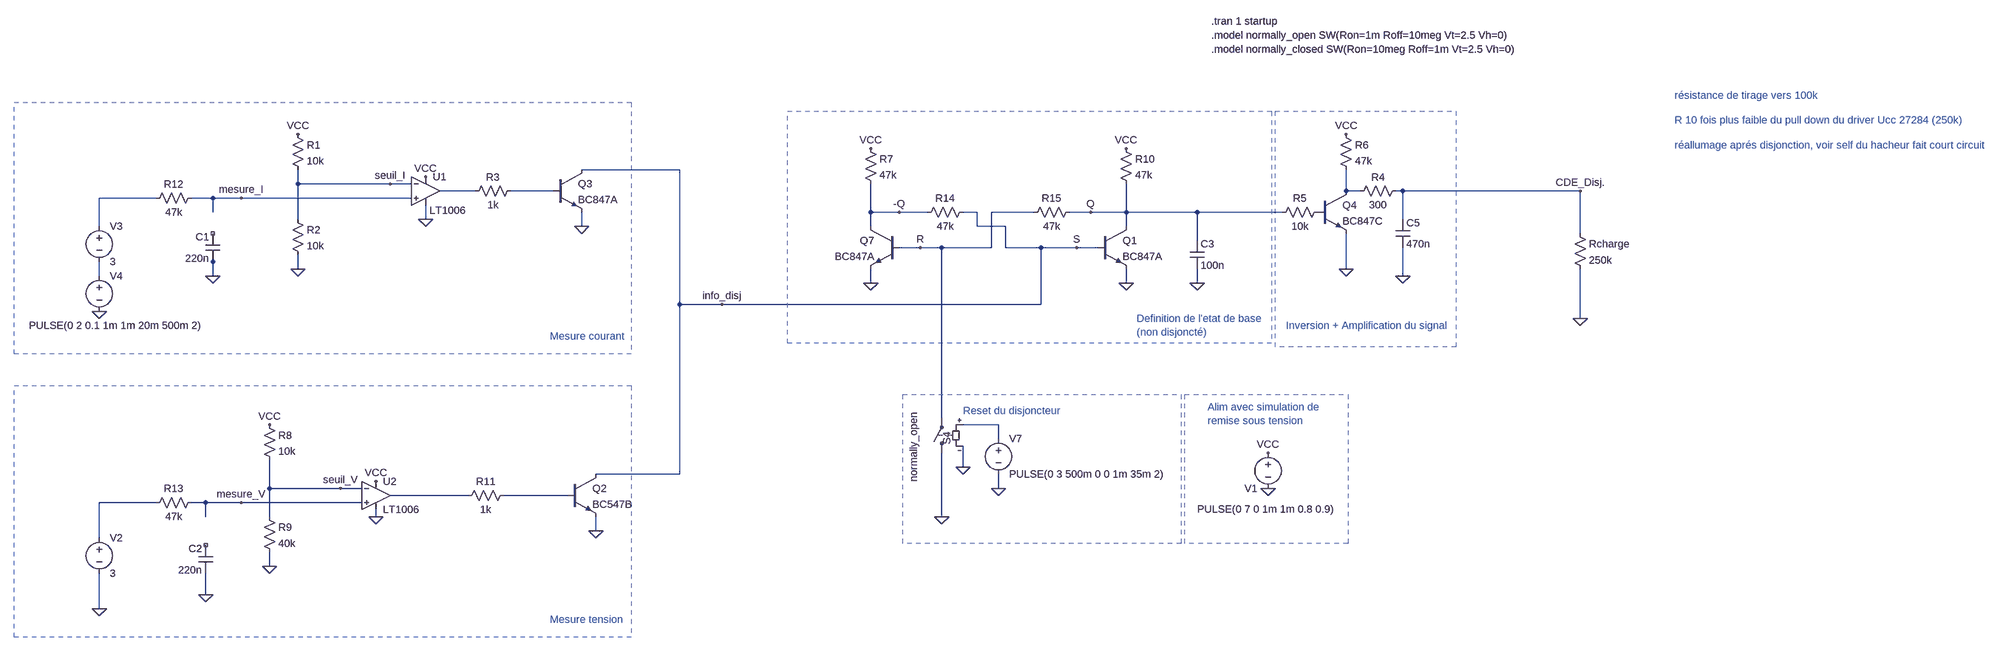
[diagram p0: schematic Sesame_disjoncteur_basculeRS_3t.asc]
Sesame_disjoncteur_basculeRS_3t.asc, the LTspice schematic file:
Version 4
SHEET 1 4456 1012
WIRE 816 -48 592 -48
WIRE -48 -16 -48 -48
WIRE 160 -16 -48 -16
WIRE 208 -16 160 -16
WIRE 352 0 272 0
WIRE 528 0 432 0
WIRE 2336 0 2336 -48
WIRE 2368 0 2336 0
WIRE 2464 0 2448 0
WIRE 2864 0 2464 0
WIRE -368 16 -496 16
WIRE -240 16 -288 16
WIRE -176 16 -240 16
WIRE 208 16 -176 16
WIRE -240 48 -240 16
WIRE 1264 48 1264 -16
WIRE 1328 48 1264 48
WIRE 1392 48 1328 48
WIRE 1504 48 1472 48
WIRE 1632 48 1536 48
WIRE 1760 48 1712 48
WIRE 1840 48 1840 -16
WIRE 1840 48 1760 48
WIRE 2000 48 1840 48
WIRE 2192 48 2000 48
WIRE -48 64 -48 -16
WIRE 240 64 240 32
WIRE 2464 64 2464 0
WIRE -496 80 -496 16
WIRE 592 80 592 48
WIRE 1264 80 1264 48
WIRE 1504 80 1504 48
WIRE 1568 80 1504 80
WIRE 1840 80 1840 48
WIRE 2864 96 2864 0
WIRE 2000 112 2000 48
WIRE 1376 128 1328 128
WIRE 1424 128 1376 128
WIRE 1536 128 1536 48
WIRE 1536 128 1424 128
WIRE 1568 128 1568 80
WIRE 1648 128 1568 128
WIRE 1728 128 1648 128
WIRE 1776 128 1728 128
WIRE -240 160 -240 144
WIRE -48 176 -48 144
WIRE 2336 176 2336 96
WIRE -496 192 -496 160
WIRE -240 192 -240 160
WIRE 2464 192 2464 128
WIRE 1264 208 1264 176
WIRE 1840 208 1840 176
WIRE 2000 208 2000 176
WIRE 816 256 816 -48
WIRE 912 256 816 256
WIRE 1648 256 1648 128
WIRE 1648 256 912 256
WIRE 2864 288 2864 176
WIRE 1424 512 1424 128
WIRE 1552 528 1472 528
WIRE 1552 560 1552 528
WIRE 1472 624 1472 576
WIRE 816 640 816 256
WIRE 816 640 624 640
WIRE -112 672 -112 608
WIRE 48 672 -112 672
WIRE 96 672 48 672
WIRE 1552 672 1552 640
WIRE 336 688 160 688
WIRE 560 688 416 688
WIRE -368 704 -496 704
WIRE -256 704 -288 704
WIRE -176 704 -256 704
WIRE 96 704 -176 704
WIRE -256 736 -256 704
WIRE -112 736 -112 672
WIRE 128 736 128 720
WIRE 1424 736 1424 592
WIRE 624 768 624 736
WIRE -496 784 -496 704
WIRE -112 848 -112 816
WIRE -256 912 -256 864
WIRE -496 944 -496 864
FLAG 240 64 0
FLAG 592 80 0
FLAG 128 736 0
FLAG -48 176 0
FLAG -112 848 0
FLAG 1264 208 0
FLAG 1840 208 0
FLAG 624 768 0
FLAG 2864 288 0
FLAG -176 16 mesure_I
FLAG -176 704 mesure_V
FLAG 48 672 seuil_V
FLAG 160 -16 seuil_I
FLAG 2864 0 CDE_Disj.
FLAG 912 256 info_disj
FLAG -240 192 0
FLAG -256 912 0
FLAG 1472 624 0
FLAG 1552 672 0
FLAG 2336 176 0
FLAG 1424 736 0
FLAG 2000 208 0
FLAG 2464 192 0
FLAG -496 272 0
FLAG -496 944 0
FLAG 1264 -96 VCC
FLAG 1840 -96 VCC
FLAG 240 -32 VCC
FLAG 128 656 VCC
FLAG -112 528 VCC
FLAG -48 -128 VCC
FLAG 2160 592 VCC
FLAG 2160 672 0
FLAG 1376 128 R
FLAG 1728 128 S
FLAG 1760 48 Q
FLAG 1328 48 -Q
FLAG 2336 -128 VCC
SYMBOL res -64 -144 R0
SYMATTR InstName R1
SYMATTR Value 10k
SYMBOL res -64 48 R0
SYMATTR InstName R2
SYMATTR Value 10k
SYMBOL res -128 512 R0
SYMATTR InstName R8
SYMATTR Value 10k
SYMBOL res -128 720 R0
SYMATTR InstName R9
SYMATTR Value 40k
SYMBOL LT1006 240 -64 R0
WINDOW 3 9 108 Left 2
SYMATTR InstName U1
SYMBOL LT1006 128 624 R0
SYMATTR InstName U2
SYMBOL voltage 2160 576 M0
WINDOW 0 24 96 Left 2
WINDOW 3 -151 143 Left 2
WINDOW 123 0 0 Left 0
WINDOW 39 0 0 Left 0
SYMATTR InstName V1
SYMATTR Value PULSE(0 7 0 1m 1m 0.8 0.9)
SYMBOL res 1488 32 R90
WINDOW 0 0 56 VBottom 2
WINDOW 3 32 56 VTop 2
SYMATTR InstName R14
SYMATTR Value 47k
SYMBOL res 1728 32 R90
WINDOW 0 0 56 VBottom 2
WINDOW 3 32 56 VTop 2
SYMATTR InstName R15
SYMATTR Value 47k
SYMBOL npn 528 -48 R0
SYMATTR InstName Q3
SYMATTR Value BC847A
SYMBOL npn 560 640 R0
SYMATTR InstName Q2
SYMATTR Value BC547B
SYMBOL res 1248 -112 R0
SYMATTR InstName R7
SYMATTR Value 47k
SYMBOL res 1824 -112 R0
SYMATTR InstName R10
SYMATTR Value 47k
SYMBOL res 2848 80 R0
SYMATTR InstName Rcharge
SYMATTR Value 250k
SYMBOL res -384 32 R270
WINDOW 0 32 56 VTop 2
WINDOW 3 0 56 VBottom 2
SYMATTR InstName R12
SYMATTR Value 47k
SYMBOL cap -224 160 R180
WINDOW 0 24 56 Left 2
WINDOW 3 24 8 Left 2
SYMATTR InstName C1
SYMATTR Value 220n
SYMBOL cap -240 864 R180
WINDOW 0 24 56 Left 2
WINDOW 3 24 8 Left 2
SYMATTR InstName C2
SYMATTR Value 220n
SYMBOL res -272 688 R90
WINDOW 0 0 56 VBottom 2
WINDOW 3 32 56 VTop 2
SYMATTR InstName R13
SYMATTR Value 47k
SYMBOL voltage 1552 544 R0
WINDOW 123 0 0 Left 0
WINDOW 39 0 0 Left 0
SYMATTR InstName V7
SYMATTR Value PULSE(0 3 500m 0 0 1m 35m 2)
SYMBOL sw 1424 608 R180
WINDOW 38 63 -50 VRight 2
WINDOW 0 -12 64 VLeft 2
SYMATTR SpiceModel normally_open
SYMATTR InstName S4
SYMATTR Value ""
SYMBOL npn 2272 0 R0
SYMATTR InstName Q4
SYMATTR Value BC847C
SYMBOL res 2320 -144 R0
SYMATTR InstName R6
SYMATTR Value 47k
SYMBOL npn 1328 80 M0
SYMATTR InstName Q7
SYMATTR Value BC847A
SYMBOL npn 1776 80 R0
SYMATTR InstName Q1
SYMATTR Value BC847A
SYMBOL cap 1984 112 R0
SYMATTR InstName C3
SYMATTR Value 100n
SYMBOL cap 2448 64 R0
SYMATTR InstName C5
SYMATTR Value 470n
SYMBOL res 2464 -16 R90
WINDOW 0 0 56 VBottom 2
WINDOW 3 32 56 VTop 2
SYMATTR InstName R4
SYMATTR Value 300
SYMBOL voltage -496 768 R0
WINDOW 123 0 0 Left 0
WINDOW 39 0 0 Left 0
SYMATTR InstName V2
SYMATTR Value 3
SYMBOL voltage -496 64 R0
WINDOW 123 0 0 Left 0
WINDOW 39 0 0 Left 0
SYMATTR InstName V3
SYMATTR Value 3
SYMBOL voltage -496 176 R0
WINDOW 123 0 0 Left 0
WINDOW 39 0 0 Left 0
WINDOW 3 -159 128 Left 2
SYMATTR InstName V4
SYMATTR Value PULSE(0 2 0.1 1m 1m 20m 500m 2)
SYMBOL res 448 -16 R90
WINDOW 0 0 56 VBottom 2
WINDOW 3 32 56 VTop 2
SYMATTR InstName R3
SYMATTR Value 1k
SYMBOL res 2288 32 R90
WINDOW 0 0 56 VBottom 2
WINDOW 3 32 56 VTop 2
SYMATTR InstName R5
SYMATTR Value 10k
SYMBOL res 432 672 R90
WINDOW 0 0 56 VBottom 2
WINDOW 3 32 56 VTop 2
SYMATTR InstName R11
SYMATTR Value 1k
TEXT 2032 -384 Left 2 !.tran 1 startup
TEXT 520 328 Left 2 ;Mesure courant
TEXT 520 968 Left 2 ;Mesure tension
TEXT 2032 -320 Left 2 !.model normally_closed SW(Ron=10meg Roff=1m Vt=2.5 Vh=0)
TEXT 2032 -352 Left 2 !.model normally_open SW(Ron=1m Roff=10meg Vt=2.5 Vh=0)
TEXT 3680 -160 Left 2 ;R 10 fois plus faible du pull down du driver Ucc 27284 (250k)
TEXT 3680 -104 Left 2 ;réallumage aprés disjonction, voir self du hacheur fait court circuit
TEXT 3680 -216 Left 2 ;résistance de tirage vers 100k
TEXT 1864 288 Left 2 ;Definition de l'etat de base\n(non disjoncté)
TEXT 1472 496 Left 2 ;Reset du disjoncteur
TEXT 2024 488 Left 2 ;Alim avec simulation de\nremise sous tension
TEXT 2200 304 Left 2 ;Inversion + Amplification du signal
RECTANGLE Normal 1336 460 1964 796 2
RECTANGLE Normal 1972 460 2340 796 2
RECTANGLE Normal 1076 -180 2168 344 2
RECTANGLE Normal 2176 -180 2584 352 2
RECTANGLE Normal 704 368 -688 -200 2
RECTANGLE Normal 704 1008 -688 440 2

The netlist it stands for:
* Sesame_disjoncteur_basculeRS_3t.asc
R1 VCC seuil_I 10k
R2 seuil_I 0 10k
R8 VCC seuil_V 10k
R9 seuil_V 0 40k
XU1 mesure_I seuil_I VCC 0 N001 LT1006  ; pins In+ In- V+ V- OUT
XU2 mesure_V seuil_V VCC 0 N007 LT1006  ; pins In+ In- V+ V- OUT
V1 VCC 0 PULSE(0 7 0 1m 1m 0.8 0.9)
R14 S -Q 47k
R15 Q R 47k
Q3 S N002 0 0 BC847A
Q2 S N008 0 0 BC547B
R7 VCC -Q 47k
R10 VCC Q 47k
Rcharge CDE_Disj. 0 250k
R12 N004 mesure_I 47k
C1 0 NC_01 220n
C2 0 NC_02 220n
R13 mesure_V N009 47k
V7 N006 0 PULSE(0 3 500m 0 0 1m 35m 2)
S4 0 R N006 0 normally_open
Q4 N003 P001 0 0 BC847C
R6 VCC N003 47k
Q7 -Q R 0 0 BC847A
Q1 Q S 0 0 BC847A
C3 Q 0 100n
C5 CDE_Disj. 0 470n
R4 CDE_Disj. N003 300
V2 N009 0 3
V3 N004 N005 3
V4 N005 0 PULSE(0 2 0.1 1m 1m 20m 500m 2)
R3 N002 N001 1k
R5 P001 Q 10k
R11 N008 N007 1k
.model NPN NPN
.model PNP PNP
.lib standard.bjt
.tran 1 startup
* Mesure courant
* Mesure tension
.model normally_closed SW(Ron=10meg Roff=1m Vt=2.5 Vh=0)
.model normally_open SW(Ron=1m Roff=10meg Vt=2.5 Vh=0)
* R 10 fois plus faible du pull down du driver Ucc 27284 (250k)
* réallumage aprés disjonction, voir self du hacheur fait court circuit
* résistance de tirage vers 100k
* Definition de l'etat de base
* (non disjoncté)
* Reset du disjoncteur
* Alim avec simulation de
* remise sous tension
* Inversion + Amplification du signal
.lib LTC.lib
.backanno
.end